# EasyEDA Pro project Universal-DB9.epro

# Schematic Schematic1
Board Name: Board1; Create Date: 2025-12-12; Page Name: P1; Project Name: Gampead; Schematic Name: Schematic1; Update Date: 2025-12-13; Company: EasyEDA.com; Page Size: A4; Version: V1.0
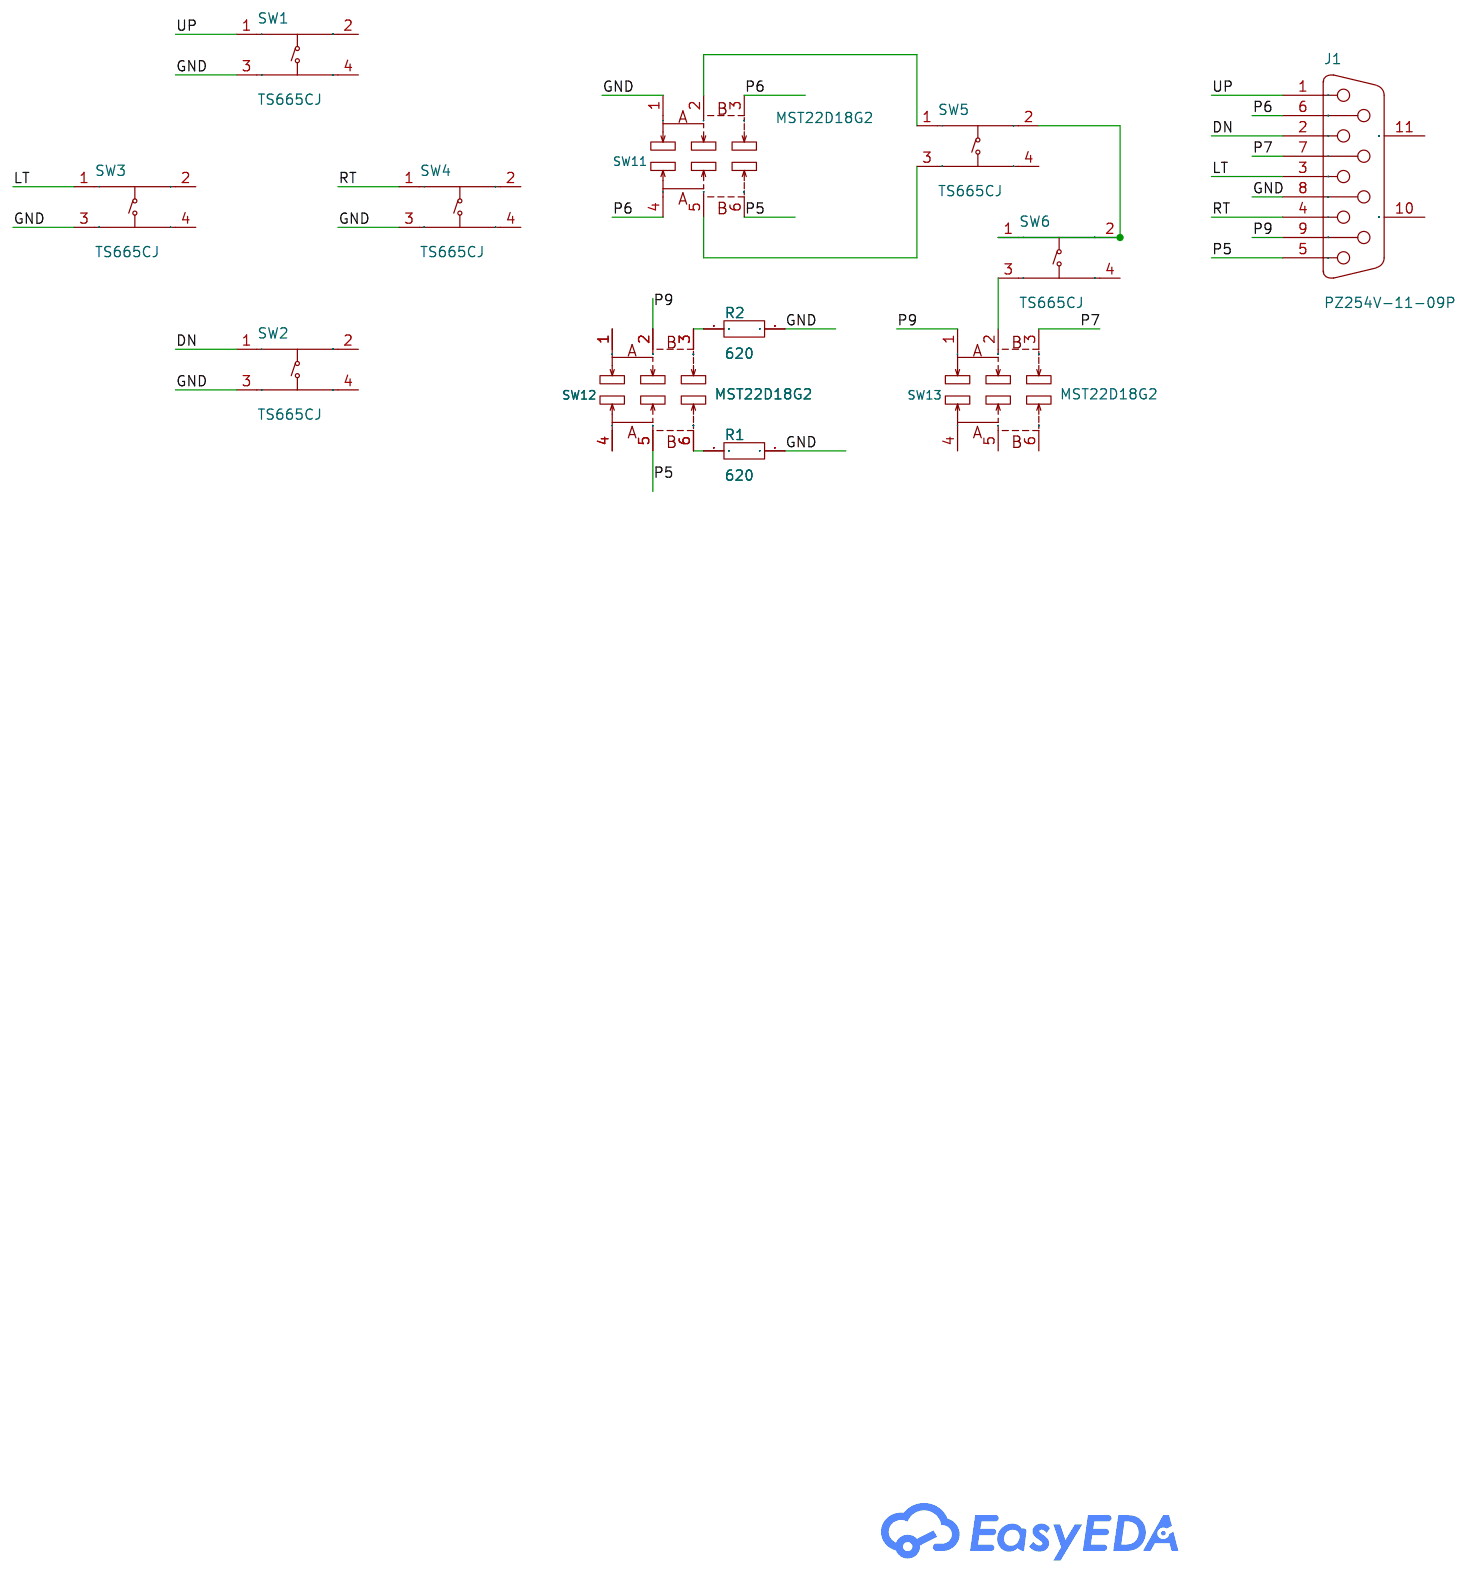
[diagram p0: schematic sheet]

## Parts
J1  PZ254V-11-09P  [HDR-TH_9P-P2.54-V-M]
R1  620  [Resistor]
R2  620  [Resistor]
SW1  TS665CJ  [SW-TH_4P-L6.0-W6.0-P4.50-LS6.5]
SW2  TS665CJ  [SW-TH_4P-L6.0-W6.0-P4.50-LS6.5]
SW3  TS665CJ  [SW-TH_4P-L6.0-W6.0-P4.50-LS6.5]
SW4  TS665CJ  [SW-TH_4P-L6.0-W6.0-P4.50-LS6.5]
SW5  TS665CJ  [SW-TH_4P-L6.0-W6.0-P4.50-LS6.5]
SW6  TS665CJ  [SW-TH_4P-L6.0-W6.0-P4.50-LS6.5]
SW11  MST22D18G2  [SW-SMD_MST22D18G2]
SW12  MST22D18G2  [SW-SMD_MST22D18G2]
SW13  MST22D18G2  [SW-SMD_MST22D18G2]

## Library data of the parts
J1 = PZ254V-11-09P: Pin Structure:1x9P Pitch:2.54mm Row Spacing:- Circluar Pins/Square Pins:Pin Header Mounting Type:Through Hole Number of Rows:1 Number of Pins:9P Current Rating:- Voltage Rating (Max):- Length of Mating Pin:6mm Insulation Height:2.5mm Length of End Connect; LCSC Part Name: 1x9P 间距:2.54mm 方针 直插; Supplier Part: C492408; Manufacturer: XFCN(兴飞); Supplier Footprint: 插件,P=2.54mm; JLCPCB Part Class: Extended Part; Datasheet: https://item.szlcsc.com/datasheet/PZ254V-11-09P/502964.html; Supplier: LCSC; Pin Structure: 1x9P; Pitch: 2.54mm; Circluar Pins/Square Pins: Pin Header; Mounting Type: Through Hole; Number of Rows: 1; Number of Pins: 9P; Length of Mating Pin: 6mm; Insulation Height: 2.5mm; Length of End Connection Pin: 3mm; Contact Material: Brass; Operating Temperature: -40℃~+105℃; Color: Black
R1 R2 = Res_0603: Supplier Footprint: 0603
SW1-SW6 = TS665CJ: Circuit:SPST Actuator Style:Round Button Operating Force:2.5N Mounting Type:Through Hole Length:6mm Width:6mm Switch Height:5mm with Bracket:Without Bracket Contact Current:50mA Voltage Rating:12V Actuator/Cap Color:Black With Lamp:No Termination Style:PC; LCSC Part Name: 6*6*5mm 直插 轻触开关; Supplier Part: C393938; Manufacturer: SHOU HAN(首韩); Supplier Footprint: 插件-4P,6x6mm; JLCPCB Part Class: Extended Part; Datasheet: https://item.szlcsc.com/datasheet/TS665CJ/372550.html; Supplier: LCSC; Circuit: SPST; Actuator Style: Round Button; Operating Force: 2.5N; Mounting Type: Through Hole; Length: 6mm; Width: 6mm; Switch Height: 5mm; with Bracket: Without Bracket; Contact Current: 50mA; Voltage Rating: 12V; Actuator/Cap Color: Black; With Lamp: No; Termination Style: PC Pin; Life: 50,000 Cycles; Operating Temperature: -25℃~+70℃
SW11-SW13 = MST22D18G2: Circuit:DPDT Actuator Style:- Termination Style:SMD(SMT) Tab Length:9.1mm Width:3.6mm Switch Height:3.45mm Mounting Type:Surface Mount,Vertical Actuator Color:- Current Rating:50mA Voltage Rating:12V Life:10,000 Cycles Operating Temperature:-30℃~+80℃ Oper; LCSC Part Name: 两档立式贴片 6脚拨动 柄长2.0MM; Supplier Part: C431544; Manufacturer: SHOU HAN(首韩); Supplier Footprint: SMD,9.1x3.6mm; JLCPCB Part Class: Extended Part; Datasheet: https://item.szlcsc.com/datasheet/MST22D18G2/427901.html; Supplier: LCSC; Circuit: DPDT; Termination Style: SMD(SMT) Tab; Length: 9.1mm; Width: 3.6mm; Switch Height: 3.45mm; Mounting Type: Surface Mount,Vertical; Current Rating: 50mA; Voltage Rating: 12V; Life: 10,000 Cycles; Operating Temperature: -30℃~+80℃

## Nets
GND: J1.8 R1.2 R2.2 SW1.3(C) SW2.3(C) SW3.3(C) SW4.3(C) SW11.1
DN: J1.2 SW2.1(A)
LT: J1.3 SW3.1(A)
P5: J1.5 SW11.6 SW12.5
P6: J1.6 SW11.3 SW11.4
P7: J1.7 SW13.3
P9: J1.9 SW12.2 SW13.1
RT: J1.4 SW4.1(A)
UP: J1.1 SW1.1(A)
$1N1161: SW5.2(B) SW6.1(A) SW6.2(B)
$1N1616: SW5.1(A) SW11.2
$1N1625: SW5.3(C) SW11.5
$1N1687: R1.1 SW12.6
$1N1693: R2.1 SW12.3
$1N1826: SW6.3(C) SW13.2

Not connected (* = marked no-connect by the designer): J1 10(MH1) 11(MH2); SW1 2(B) 4(D); SW2 2(B) 4(D); SW3 2(B) 4(D); SW4 2(B) 4(D); SW5 4(D); SW6 4(D); SW12 1 4; SW13 4 5 6

# Board PCB1
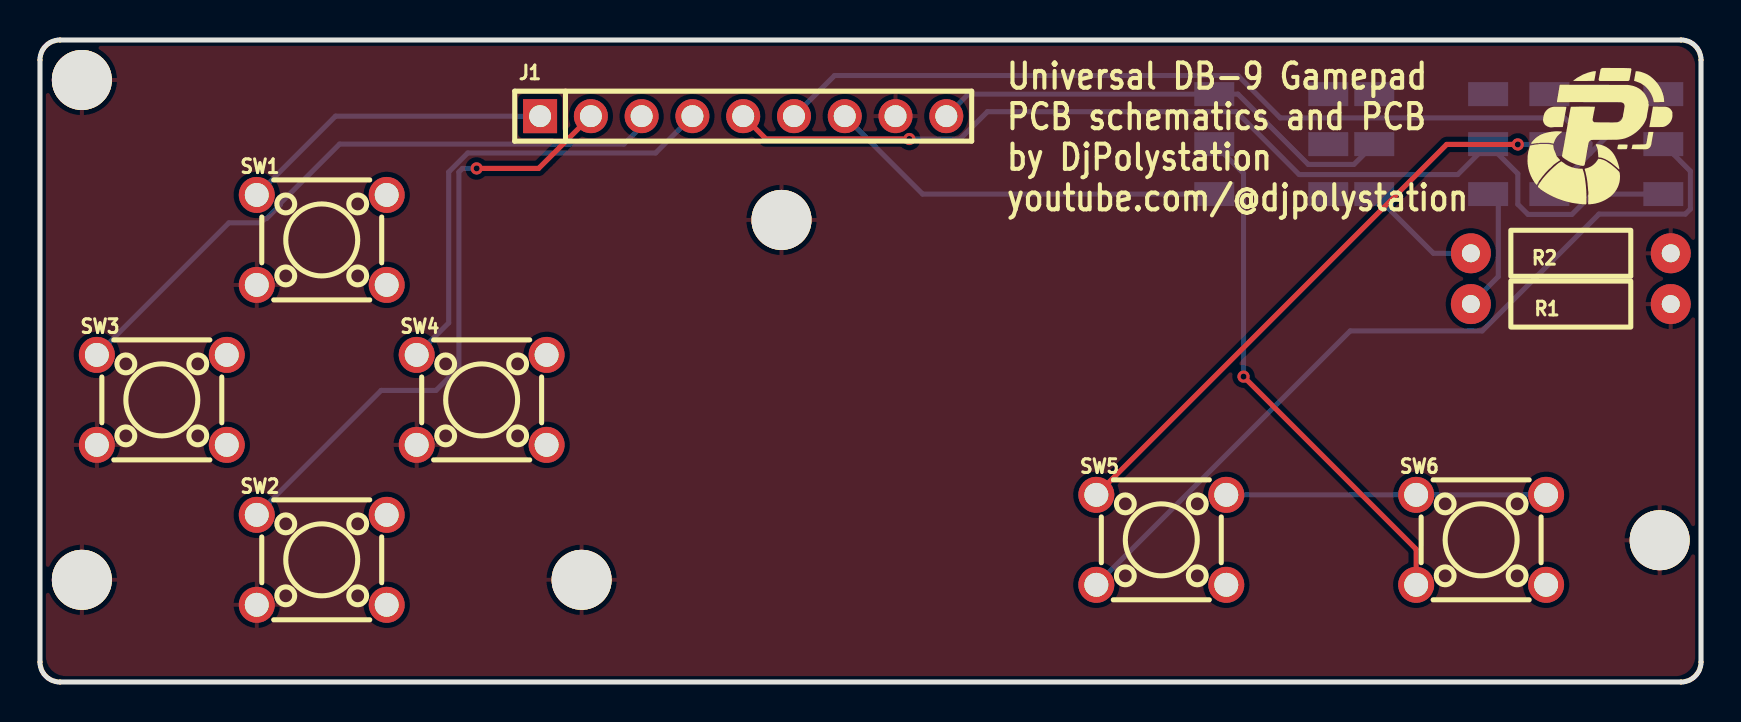
[diagram p1: board, top side]
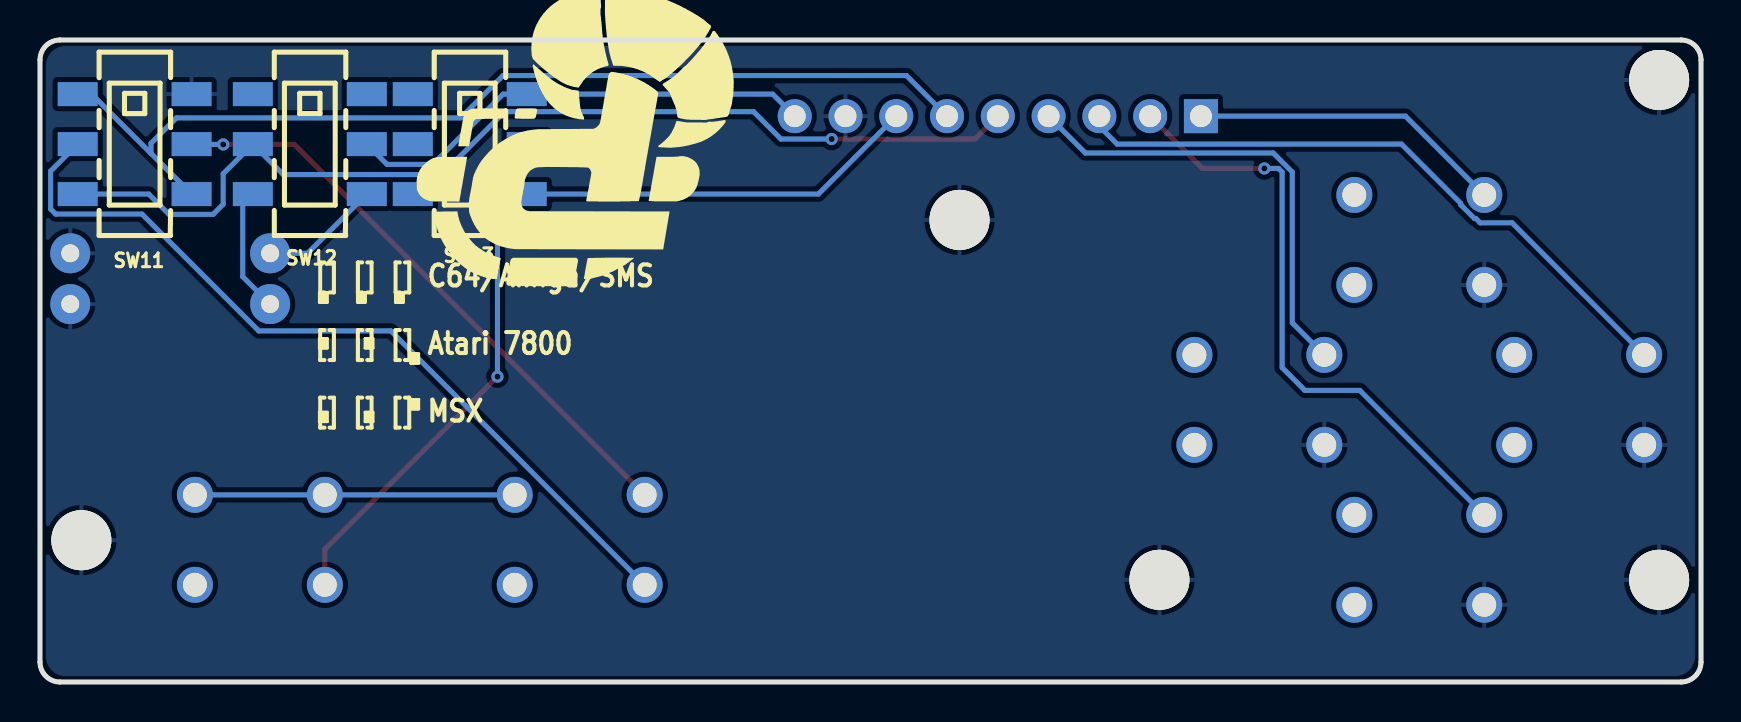
[diagram p2: board, bottom side, seen from below]

Outline 83.09 x 32.11 mm; copper layers: Top Layer, Bottom Layer. Coordinates in mm from the lower left corner of the outline.
Outline path: 0,31.11 0,1 arc(0.29,0.29) 1,0 82.09,0 arc(82.8,0.29) 83.09,1 83.09,31.11 arc(82.8,31.82) 82.09,32.11 1,32.11 arc(0.29,31.82) 0,31.11
Stack: Top Layer 0.035mm / Dielectric1 1.51mm FR4 er 4.5 / Bottom Layer 0.035mm

## Design rules (mm)
template: JLCPCB Capability(Two Layers Board)
spacing copperThickness1oz (default): track to track 0.102, other pairs 0.152 to 0.3
spacing copperThickness2oz: track to track 0.203, other pairs 0.152 to 0.3
track width copperThickness1oz (default): min 0.127, default 0.254, max 2.54
track width copperThickness2oz: min 0.203, default 0.254, max 2.54
differential pair differentialPair (default): width min 0.127, default 0.254, max 2.54; gap min 0.152, default 0.152
via viaSize (default): diameter min 0.5, default 0.61, max 10; hole min 0.3, default 0.305, max 6.3

## Placement (name value [footprint] x y rotation side)
J1  PZ254V-11-09P  [HDR-TH_9P-P2.54-V-M]  35.18 28.3 0 top
NOREF  -  [Pad_e151]  37.09 23.11 0 top
NOREF#2  -  [Pad_e147]  2.09 30.11 0 top
NOREF#3  -  [Pad_e152]  81.03 7.09 0 top
NOREF#4  -  [Pad_e149]  2.09 5.11 0 top
NOREF#5  -  [Pad_e150]  27.09 5.11 0 top
R1  620  [Resistor]  76.58 18.9 0 top
R2  620  [Resistor]  76.58 21.44 0 top
SW1  TS665CJ  [SW-TH_4P-L6.0-W6.0-P4.50-LS6.5]  14.09 22.11 0 top
SW2  TS665CJ  [SW-TH_4P-L6.0-W6.0-P4.50-LS6.5]  14.09 6.11 0 top
SW3  TS665CJ  [SW-TH_4P-L6.0-W6.0-P4.50-LS6.5]  6.09 14.11 0 top
SW4  TS665CJ  [SW-TH_4P-L6.0-W6.0-P4.50-LS6.5]  22.09 14.11 0 top
SW5  TS665CJ  [SW-TH_4P-L6.0-W6.0-P4.50-LS6.5]  56.09 7.11 0 top
SW6  TS665CJ  [SW-TH_4P-L6.0-W6.0-P4.50-LS6.5]  72.09 7.11 0 top
SW11  MST22D18G2  [SW-SMD_MST22D18G2]  78.36 26.9 270 bottom
SW12  MST22D18G2  [SW-SMD_MST22D18G2]  69.6 26.9 270 bottom
SW13  MST22D18G2  [SW-SMD_MST22D18G2]  61.59 26.9 270 bottom

## Footprints (pads in the part's own frame, mm; a bottom-side part is the same pattern mirrored in y, then rotated)
HDR-TH_9P-P2.54-V-M
  rect 1.7x1.7 hole 1.1: 1(-10.16,0)
  round 1.7 hole 1.1: 2(-7.62,0) 3(-5.08,0) 4(-2.54,0) 5(0,0) 6(2.54,0) 7(5.08,0) 8(7.62,0) 9(10.16,0)
Pad_e147
  round 3 hole 3: 1(0,0)
Pad_e149
  round 3 hole 3: 1(0,0)
Pad_e150
  round 3 hole 3: 1(0,0)
Pad_e151
  round 3 hole 3: 1(0,0)
Pad_e152
  round 3 hole 3: 1(0,0)
Resistor
  round 2 hole 0.9: 1(-5,0) 2(5,0)
SW-SMD_MST22D18G2
  rect 1.2x2 smd: 1(-2.5,2.85) 2(0,2.85) 3(2.5,2.85) 4(-2.5,-2.85) 5(0,-2.85) 6(2.5,-2.85)
SW-TH_4P-L6.0-W6.0-P4.50-LS6.5
  round 1.8 hole 1.2: 1(-3.25,2.25) 2(3.25,2.25) 3(-3.25,-2.25) 4(3.25,-2.25)

## Nets
As in the schematic, except:
GND: J1.8 NOREF.1 NOREF#2.1 NOREF#3.1 NOREF#4.1 NOREF#5.1 R1.2 R2.2 SW1.3 SW2.3 SW3.3 SW4.3 SW11.1

Pads without a net: SW1 2 4; SW2 2 4; SW3 2 4; SW4 2 4; SW5 4; SW6 4; SW12 1 4; SW13 4 5 6

## Via types
v1: diameter 0.61, hole 0.305, Top Layer to Bottom Layer, 4 vias

## Routing (per net, layer and track width the routed paths; a pad name or vN(x,y) marks a point on that pad's centre or on a via; arc(x,y) is an arc through that point)
DN: length 30.7
  Top Layer w0.254: v1(21.84,25.69) 24.94,25.69 J1.2
  Bottom Layer w0.254: v1(21.84,25.69) 21.13,25.69 20.96,25.51 20.96,15.73 19.81,14.59 17.07,14.59 SW2.1
LT: length 32.5
  Bottom Layer w0.254: J1.3 30.1,27.79 29.21,26.9 14.99,26.9 12.02,23.94 12.02,23.87 11.33,23.18 11.26,23.18 11.05,22.97 9.45,22.97 SW3.1
P5: length 51.8
  Top Layer w0.254: J1.5 36.32,27.16 v1(43.49,27.16)
  Bottom Layer w0.254: v1(43.49,27.16) 46.03,27.16 47.4,28.53 59.85,28.53 62.99,25.38 70.92,25.38 SW12.5 73.93,25.42 73.93,23.9 74.44,23.39 76.64,23.39 77.65,24.4 SW11.6
P6: length 50.3
  Bottom Layer w0.254: SW11.3 77.54,26.44 ; 77.54,26.44 80.51,29.4 SW11.4 ; 77.54,26.44 77.54,26.94 76.27,28.21 62.05,28.21 59.93,30.33 39.75,30.33 J1.6
P7: length 20.1
  Bottom Layer w0.254: J1.7 44.16,24.4 SW13.3
P9: length 23.7
  Bottom Layer w0.254: SW12.2 65.73,25.89 63.44,25.89 59.93,29.4 SW13.1 46.44,29.4 J1.9
RT: length 23.2
  Bottom Layer w0.254: SW4.1 20.45,17.96 20.45,25.51 21.4,26.46 30.8,26.46 J1.4
UP: length 15.8
  Bottom Layer w0.254: SW1.1 14.78,28.3 J1.1
$1N1161: length 16
  Bottom Layer w0.254: SW5.2 SW6.1 SW6.2
$1N1616: length 29.9
  Top Layer w0.254: SW5.1 70.37,26.89 v1(73.93,26.89)
  Bottom Layer w0.254: SW11.2 75.49,26.89 v1(73.93,26.89)
$1N1625: length 41.3
  Bottom Layer w0.254: SW11.5 82.56,25.55 82.56,23.66 82.31,23.4 77.99,23.4 72.15,17.56 65.54,17.56 SW5.3
$1N1687: length 6.3
  Bottom Layer w0.254: R1.1 72.95,20.28 72.95,23.9 SW12.6
$1N1693: length 6.1
  Bottom Layer w0.254: SW12.3 69.71,21.44 R2.1
$1N1826: length 26.2
  Top Layer w0.254: SW6.3 68.84,6.64 v1(60.21,15.28)
  Bottom Layer w0.254: SW13.2 60.21,25.44 v1(60.21,15.28)

## Copper pours and planes (outline as drawn; the poured copper is in the pictures)
GND on Top Layer: 0.29,30.82 0.31,30.99 0.36,31.19 0.46,31.37 0.59,31.53 0.74,31.65 0.92,31.75 1.12,31.8 1.29,31.82 81.8,31.82 81.98,31.8 82.17,31.75 82.35,31.65 82.51,31.53 82.64,31.37 82.73,31.19 82.79,30.99 82.8,30.82 82.8,1.29 82.79,1.12 82.73,0.92 82.64,0.74 82.51,0.59 82.35,0.46 82.17,0.36 81.98,0.31 81.8,0.29 1.29,0.29 1.12,0.31 0.92,0.36 0.74,0.46 0.59,0.59 0.46,0.74 0.36,0.92 0.31,1.12 0.29,1.29
GND on Bottom Layer: 0.29,30.82 0.31,30.99 0.36,31.19 0.46,31.37 0.59,31.53 0.74,31.65 0.92,31.75 1.12,31.8 1.29,31.82 81.8,31.82 81.98,31.8 82.17,31.75 82.35,31.65 82.51,31.53 82.64,31.37 82.73,31.19 82.79,30.99 82.8,30.82 82.8,1.29 82.79,1.12 82.73,0.92 82.64,0.74 82.51,0.59 82.35,0.46 82.17,0.36 81.98,0.31 81.8,0.29 1.29,0.29 1.12,0.31 0.92,0.36 0.74,0.46 0.59,0.59 0.46,0.74 0.36,0.92 0.31,1.12 0.29,1.29

## Text on the board
Bottom Silkscreen Layer: [] [] [] C64/Amiga/SMS / [] [] [] Atari 7800 / [] [] [] MSX | ■ | ■   ■   ■
Top Silkscreen Layer: Universal DB-9 Gamepad / PCB schematics and PCB / by DjPolystation / youtube.com/@djpolystation
